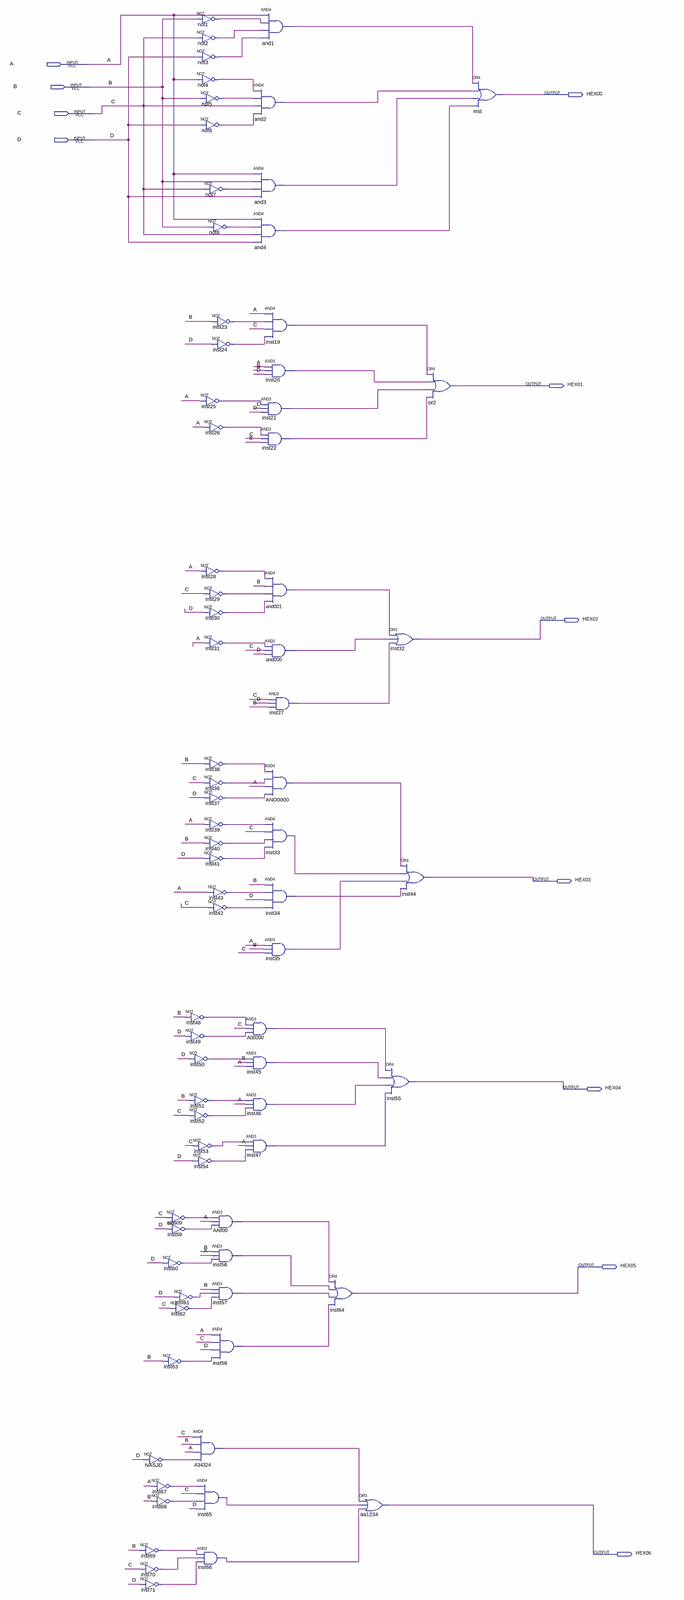
[diagram p0: schematic sheet, whole]
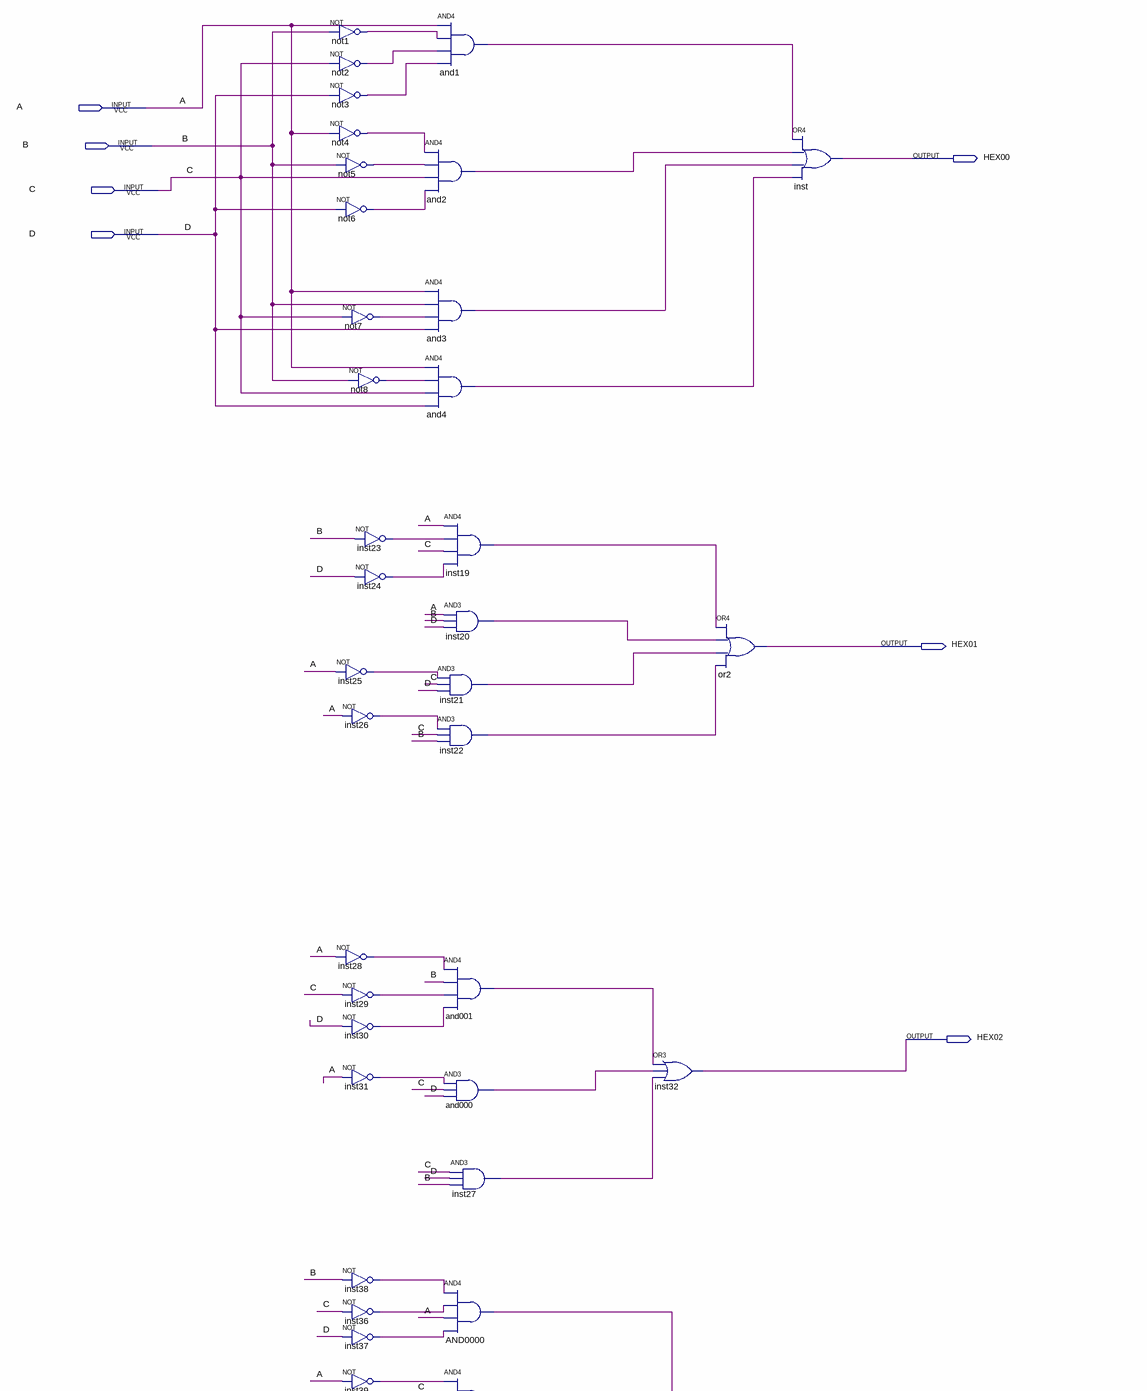
[diagram p1: schematic sheet, upper part]
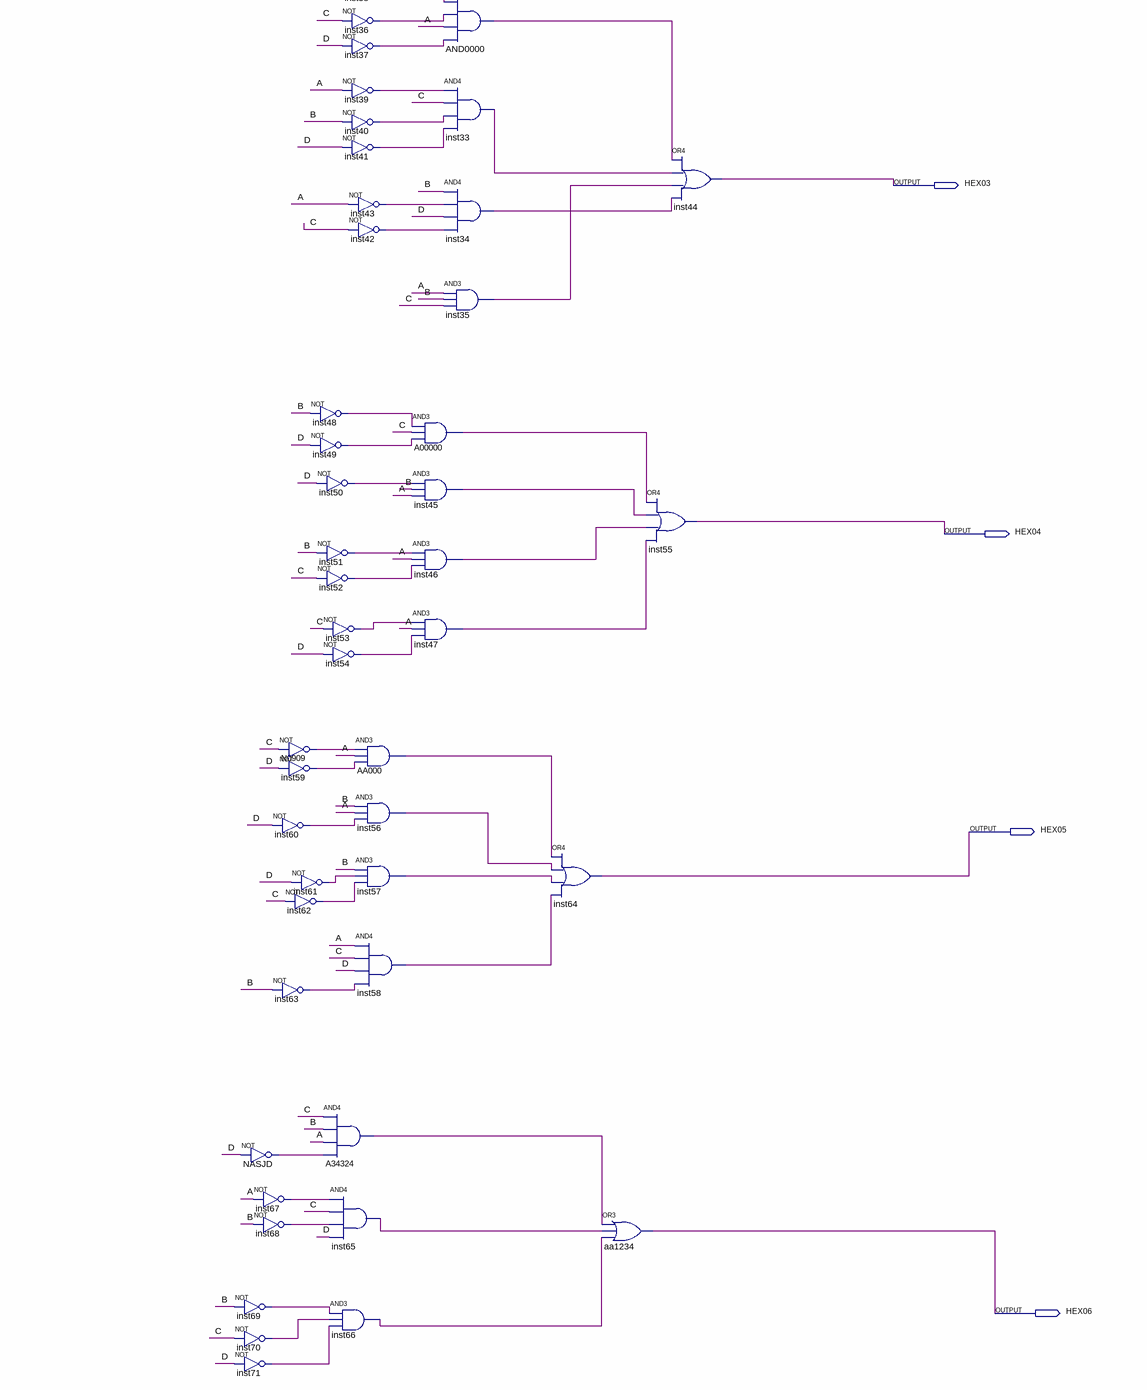
[diagram p2: schematic sheet, lower part]
// Quartus schematic display7seg.bdf as structural Verilog: 76 symbols, 11 pins
module display7seg (
  input  A,
  input  B,
  input  C,
  input  D,
  output HEX00,
  output HEX01,
  output HEX02,
  output HEX03,
  output HEX04,
  output HEX05,
  output HEX06
);

  wire A00000_out, A34324_out, AA000_out, and000_out, AND0000_out, and1_out, and001_out, and2_out, and3_out,
       and4_out, inst19_out, inst20_out, inst21_out, inst22_out, inst23_out, inst24_out, inst25_out,
       inst26_out, inst27_out, inst28_out, inst29_out, inst30_out, inst31_out, inst33_out, inst34_out,
       inst35_out, inst36_out, inst37_out, inst38_out, inst39_out, inst40_out, inst41_out, inst42_out,
       inst43_out, inst45_out, inst46_out, inst47_out, inst48_out, inst49_out, inst50_out, inst51_out,
       inst52_out, inst53_out, inst54_out, inst56_out, inst57_out, inst58_out, inst59_out, inst60_out,
       inst61_out, inst62_out, inst63_out, inst65_out, inst66_out, inst67_out, inst68_out, inst69_out,
       inst70_out, inst71_out, N0909_out, NASJD_out, not1_out, not2_out, not3_out, not4_out, not5_out,
       not6_out, not7_out, not8_out;

  not N0909 (N0909_out, C);
  not inst59 (inst59_out, D);
  not inst60 (inst60_out, D);
  not inst63 (inst63_out, B);
  not NASJD (NASJD_out, D);
  not inst67 (inst67_out, A);
  not inst68 (inst68_out, B);
  not inst69 (inst69_out, B);
  not inst70 (inst70_out, C);
  not inst71 (inst71_out, D);
  not not1 (not1_out, B);
  not not2 (not2_out, C);
  not not3 (not3_out, D);
  not not4 (not4_out, A);
  not inst48 (inst48_out, B);
  not inst49 (inst49_out, D);
  not inst50 (inst50_out, D);
  not inst51 (inst51_out, B);
  not inst52 (inst52_out, C);
  not inst53 (inst53_out, C);
  not inst54 (inst54_out, D);
  not inst61 (inst61_out, D);
  not inst62 (inst62_out, C);
  and A34324 (A34324_out, C, B, A, NASJD_out);
  and inst65 (inst65_out, inst67_out, C, inst68_out, D);
  and inst66 (inst66_out, inst69_out, inst70_out, inst71_out);
  not not5 (not5_out, B);
  not not6 (not6_out, D);
  not not7 (not7_out, C);
  not not8 (not8_out, B);
  not inst23 (inst23_out, B);
  not inst24 (inst24_out, D);
  not inst25 (inst25_out, A);
  not inst26 (inst26_out, A);
  not inst28 (inst28_out, A);
  not inst29 (inst29_out, C);
  not inst30 (inst30_out, D);
  not inst31 (inst31_out, A);
  not inst38 (inst38_out, B);
  not inst36 (inst36_out, C);
  not inst37 (inst37_out, D);
  not inst39 (inst39_out, A);
  not inst40 (inst40_out, B);
  not inst41 (inst41_out, D);
  not inst43 (inst43_out, A);
  not inst42 (inst42_out, C);
  and AA000 (AA000_out, N0909_out, A, inst59_out);
  and inst56 (inst56_out, B, A, inst60_out);
  and inst57 (inst57_out, B, inst61_out, inst62_out);
  and inst58 (inst58_out, A, C, D, inst63_out);
  and and2 (and2_out, not4_out, not5_out, C, not6_out);
  and and3 (and3_out, A, B, not7_out, D);
  and and4 (and4_out, A, not8_out, C, D);
  and A00000 (A00000_out, inst48_out, C, inst49_out);
  and inst45 (inst45_out, inst50_out, B, A);
  and inst46 (inst46_out, inst51_out, A, inst52_out);
  and inst47 (inst47_out, inst53_out, A, inst54_out);
  and and1 (and1_out, A, not1_out, not2_out, not3_out);
  and inst19 (inst19_out, A, inst23_out, C, inst24_out);
  and inst20 (inst20_out, A, B, D);
  and inst21 (inst21_out, inst25_out, C, D);
  and inst22 (inst22_out, inst26_out, C, B);
  and and001 (and001_out, inst28_out, B, inst29_out, inst30_out);
  and and000 (and000_out, inst31_out, C, D);
  and inst27 (inst27_out, C, D, B);
  and AND0000 (AND0000_out, inst38_out, inst36_out, A, inst37_out);
  and inst33 (inst33_out, inst39_out, C, inst40_out, inst41_out);
  and inst34 (inst34_out, B, inst43_out, D, inst42_out);
  and inst35 (inst35_out, A, B, C);
  or inst64 (HEX05, AA000_out, inst56_out, inst57_out, inst58_out);
  or aa1234 (HEX06, A34324_out, inst65_out, inst66_out);
  or inst32 (HEX02, and001_out, and000_out, inst27_out);
  or inst44 (HEX03, AND0000_out, inst33_out, inst35_out, inst34_out);
  or inst55 (HEX04, A00000_out, inst45_out, inst46_out, inst47_out);
  or or2 (HEX01, inst19_out, inst20_out, inst21_out, inst22_out);
  or inst (HEX00, and1_out, and2_out, and3_out, and4_out);
endmodule
